# EAGLE schematic led_thruhole (EAGLE 9.2.2)
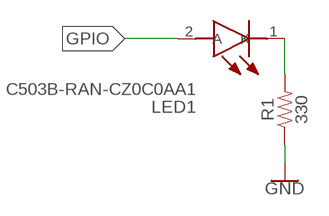
[diagram p0: schematic, sheet 1]

## Parts
LED1  C503B-RAN-CZ0C0AA1  [C503B-RAN]
R1  330  RESISTOR1206  [1206]

## Nets
GND: R1.1
GPIO: LED1.2(A)
N$1: LED1.1(K) R1.2

## Library data of the parts
LED1 = C503B-RAN-CZ0C0AA1:C503B-RAN-CZ0C0AA1: CREE - C503B-RAN-CZ0C0AA1 - LED, 5MM, RED, 32.9CD, 624NM Source: Datasheet <https://www.cree.com/led-components/media/documents/C503B-RAS-RAN-AAS-AAN-RBS-RBN-ABS-ABN-RCS-RCN-ACS-ACN-1079.pdf>; DESCRIPTION: CREE - C503B-RAN-CZ0C0AA1 - LED, 5MM, RED, 32.9CD, 624NM; HEIGHT: mm; MANUFACTURER_NAME: Cree, Inc.; MANUFACTURER_PART_NUMBER: C503B-RAN-CZ0C0AA1; MOUSER_PART_NUMBER: 941-C503BRANCZ0C0AA1; MOUSER_PRICE-STOCK: https://www.mouser.com/Search/Refine.aspx?Keyword=941-C503BRANCZ0C0AA1
R1 = SparkFun-Resistors:RESISTOR: Generic Resistor Package